# EAGLE schematic SoundKey (EAGLE 6.1)
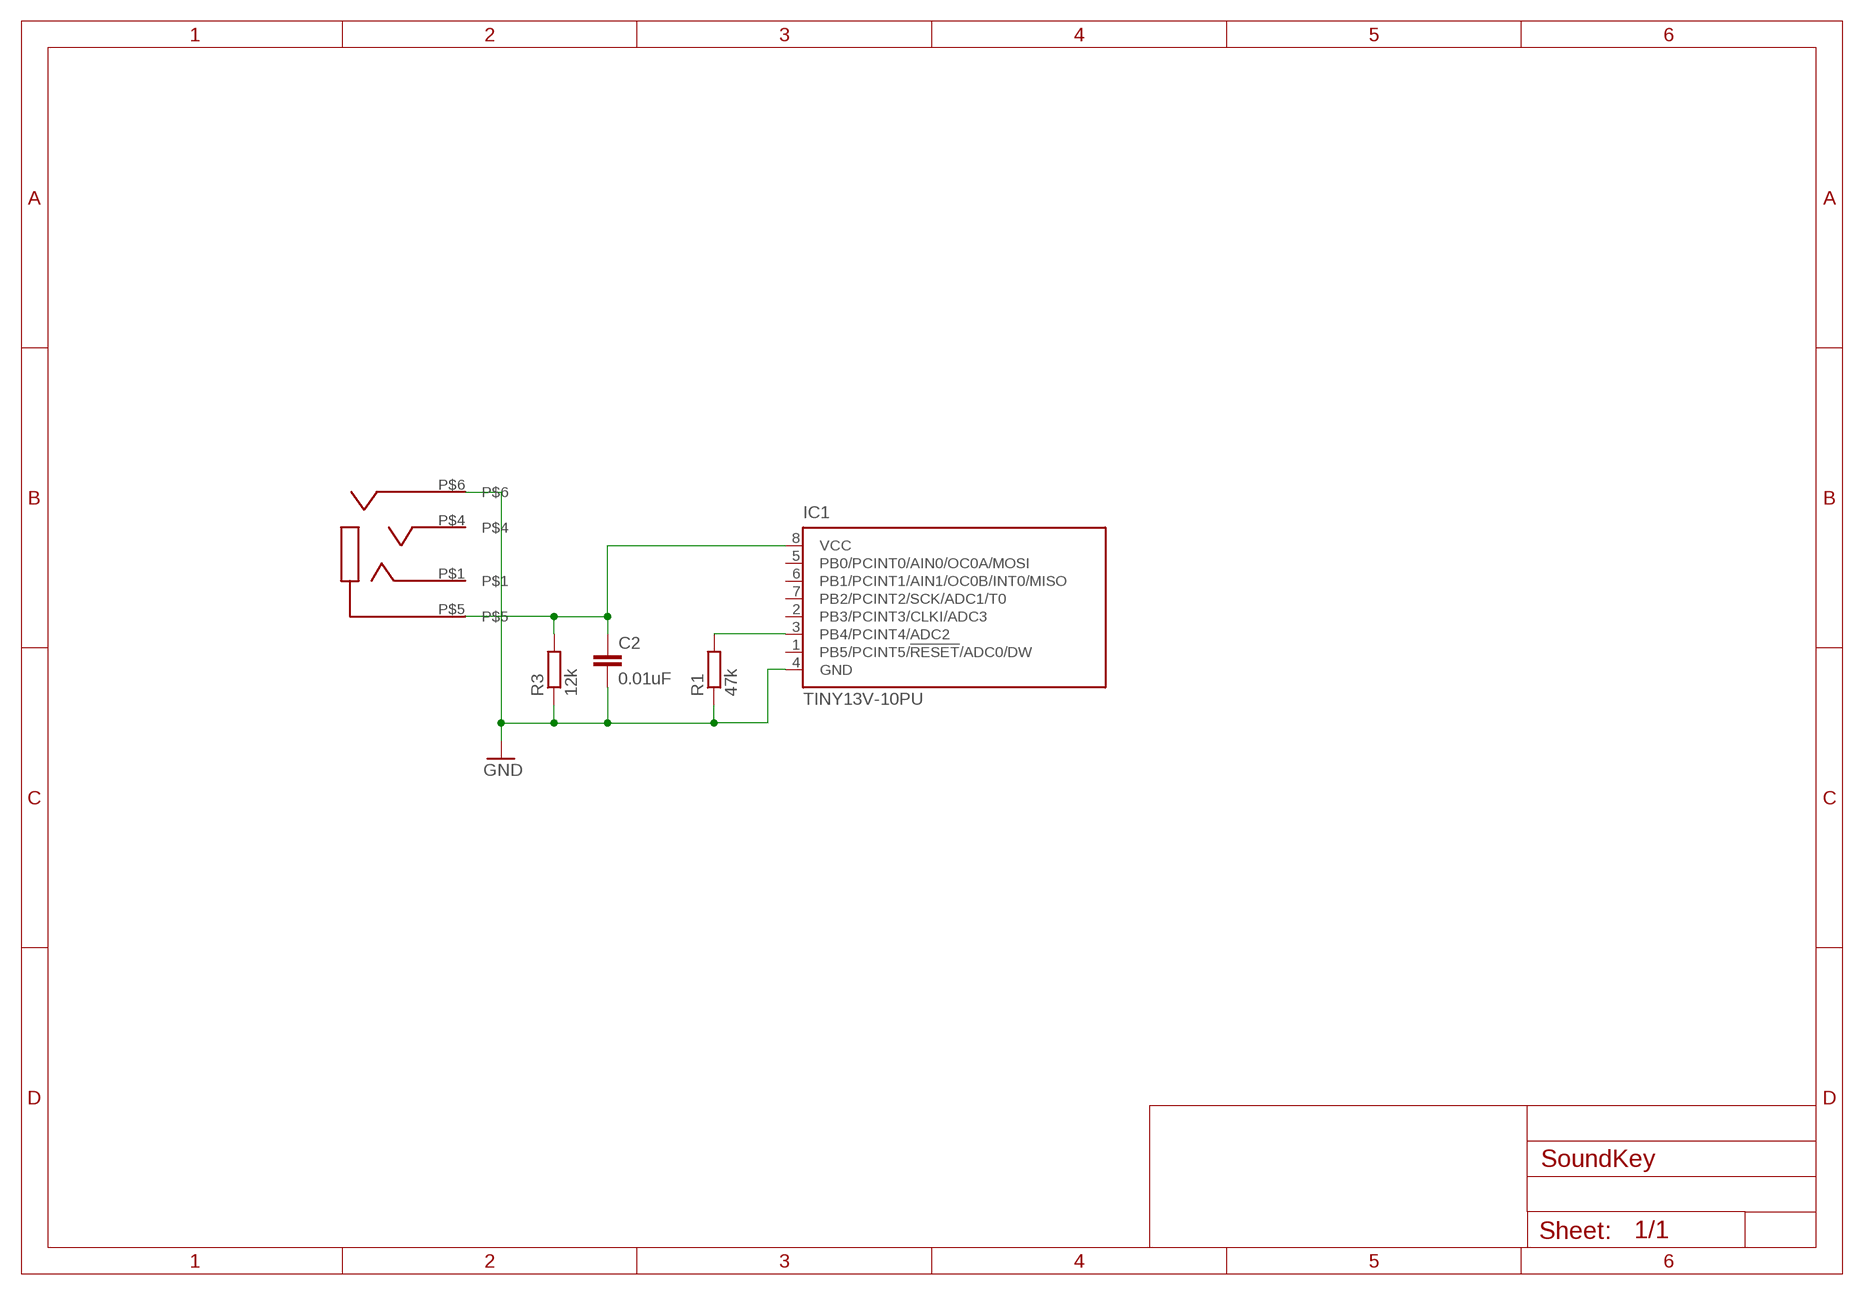
[diagram p0: schematic, sheet 1]

## Parts
C2  0.01uF  C-EU025-030X050  [C025-030X050]
IC1  TINY13V-10PU  [DIL08]
R1  47k  R-EU_0207/10  [0207/10]
R3  12k  R-EU_0207/10  [0207/10]
U$3  SJ-43514  [SJ43514]

## Nets
GND [power]: C2.2 IC1.4(GND) R1.1 R3.1 U$3.P$6
N$2: IC1.3(PB4/PCINT4/ADC2) R1.2
N$76: C2.1 IC1.8(VCC) R3.2 U$3.P$5
Unconnected: IC1.1(PB5/PCINT5/!RESET!/ADC0/DW) IC1.2(PB3/PCINT3/CLKI/ADC3) IC1.5(PB0/PCINT0/AIN0/OC0A/MOSI) IC1.6(PB1/PCINT1/AIN1/OC0B/INT0/MISO) IC1.7(PB2/PCINT2/SCK/ADC1/T0) U$3.P$1 U$3.P$4

## Library data of the parts
C2 = resistor:C-EU: CAPACITOR, European symbol
IC1 = atmel:TINY13: 8-bit AVR Microcontroller with 1K Bytes In-System Programmable Flash Source: http://www.atmel.com/dyn/resources/prod_documents/2535S.pdf; MPN: ATTINY13V-10PU; OC_FARNELL: 9171576; OC_NEWARK: 96K6523
R1 R3 = resistor:R-EU_: RESISTOR, European symbol
U$3 = con-cui-audiojack:SJ-43514

## Net classes
1 power: width 0.254 mm